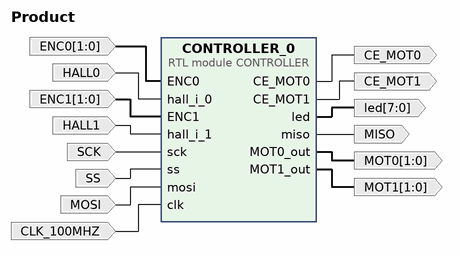
[diagram p0: block diagram of the top level]
# Vivado block design Product, xc7a35tcpg236-1, Vivado 2018.3
create_bd_design Product

create_bd_port -dir O CE_MOT0
create_bd_port -dir O CE_MOT1
create_bd_port -dir O -from 1 -to 0 MOT0
create_bd_port -dir O -from 1 -to 0 MOT1
create_bd_port -dir I -from 1 -to 0 ENC0
create_bd_port -dir I HALL0
create_bd_port -dir I -from 1 -to 0 ENC1
create_bd_port -dir I HALL1
create_bd_port -dir I SCK
create_bd_port -dir O MISO
create_bd_port -dir I SS
create_bd_port -dir I MOSI
create_bd_port -dir I -type clk CLK_100MHZ
create_bd_port -dir O -from 7 -to 0 led

create_bd_cell -type module -reference CONTROLLER CONTROLLER_0

# ---- connections ----

connect_bd_net -net CONTROLLER_0_CE_M0T0 [get_bd_pins CONTROLLER_0/CE_MOT0] [get_bd_ports CE_MOT0]
connect_bd_net -net CONTROLLER_0_CE_M0T1 [get_bd_pins CONTROLLER_0/CE_MOT1] [get_bd_ports CE_MOT1]
connect_bd_net [get_bd_pins CONTROLLER_0/MOT0_out] [get_bd_ports MOT0]
connect_bd_net [get_bd_pins CONTROLLER_0/MOT1_out] [get_bd_ports MOT1]
connect_bd_net -net ENC0_0_1 [get_bd_ports ENC0] [get_bd_pins CONTROLLER_0/ENC0]
connect_bd_net -net hall_i_0_0_1 [get_bd_ports HALL0] [get_bd_pins CONTROLLER_0/hall_i_0]
connect_bd_net -net ENC1_0_1 [get_bd_ports ENC1] [get_bd_pins CONTROLLER_0/ENC1]
connect_bd_net -net hall_i_1_0_1 [get_bd_ports HALL1] [get_bd_pins CONTROLLER_0/hall_i_1]
connect_bd_net -net sck_0_1 [get_bd_ports SCK] [get_bd_pins CONTROLLER_0/sck]
connect_bd_net [get_bd_pins CONTROLLER_0/miso] [get_bd_ports MISO]
connect_bd_net -net ss_0_1 [get_bd_ports SS] [get_bd_pins CONTROLLER_0/ss]
connect_bd_net -net mosi_0_1 [get_bd_ports MOSI] [get_bd_pins CONTROLLER_0/mosi]
connect_bd_net -net clk_0_1 [get_bd_ports CLK_100MHZ] [get_bd_pins CONTROLLER_0/clk]
connect_bd_net [get_bd_pins CONTROLLER_0/led] [get_bd_ports led]

validate_bd_design
save_bd_design
